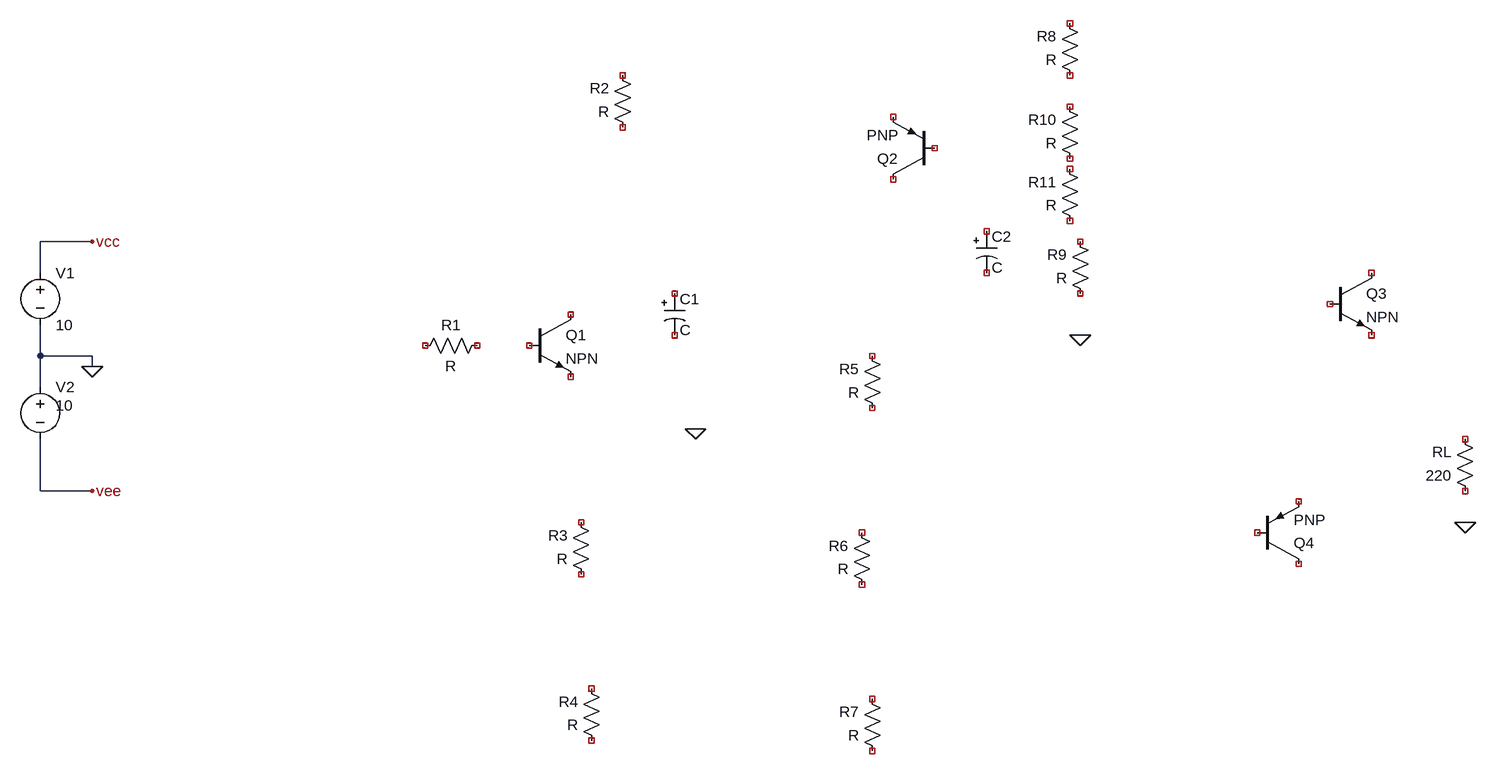
[diagram p0: schematic Draft1.asc]
Draft1.asc, the LTspice schematic file:
Version 4
SHEET 1 1636 776
WIRE -496 -16 -576 -16
WIRE -576 32 -576 -16
WIRE -576 160 -576 112
WIRE -496 160 -576 160
WIRE -496 176 -496 160
WIRE -576 208 -576 160
WIRE -576 368 -576 288
WIRE -496 368 -576 368
FLAG 1616 416 0
FLAG 432 272 0
FLAG 1024 128 0
FLAG -496 176 0
FLAG -496 368 vee
FLAG -496 -16 vcc
SYMBOL res 112 128 R90
WINDOW 0 0 56 VBottom 2
WINDOW 3 32 56 VTop 2
SYMATTR InstName R1
SYMBOL res 336 -176 R180
WINDOW 0 36 76 Left 2
WINDOW 3 36 40 Left 2
SYMATTR InstName R2
SYMBOL res 272 512 R180
WINDOW 0 36 76 Left 2
WINDOW 3 36 40 Left 2
SYMATTR InstName R3
SYMBOL res 288 768 R180
WINDOW 0 36 76 Left 2
WINDOW 3 36 40 Left 2
SYMATTR InstName R4
SYMBOL res 720 256 R180
WINDOW 0 36 76 Left 2
WINDOW 3 36 40 Left 2
SYMATTR InstName R5
SYMBOL res 704 528 R180
WINDOW 0 36 76 Left 2
WINDOW 3 36 40 Left 2
SYMATTR InstName R6
SYMBOL res 720 784 R180
WINDOW 0 36 76 Left 2
WINDOW 3 36 40 Left 2
SYMATTR InstName R7
SYMBOL res 1024 -256 R180
WINDOW 0 36 76 Left 2
WINDOW 3 36 40 Left 2
SYMATTR InstName R8
SYMBOL res 1040 80 R180
WINDOW 0 36 76 Left 2
WINDOW 3 36 40 Left 2
SYMATTR InstName R9
SYMBOL res 1024 -128 R180
WINDOW 0 36 76 Left 2
WINDOW 3 36 40 Left 2
SYMATTR InstName R10
SYMBOL res 1024 -32 R180
WINDOW 0 36 76 Left 2
WINDOW 3 36 40 Left 2
SYMATTR InstName R11
SYMBOL res 1632 384 R180
WINDOW 0 36 76 Left 2
WINDOW 3 36 40 Left 2
SYMATTR InstName RL
SYMATTR Value 220
SYMBOL npn 176 96 R0
SYMATTR InstName Q1
SYMBOL npn 1408 32 R0
SYMATTR InstName Q3
SYMBOL pnp 800 -112 R180
SYMATTR InstName Q2
SYMBOL pnp 1296 480 M180
SYMATTR InstName Q4
SYMBOL polcap 384 64 R0
SYMATTR InstName C1
SYMBOL polcap 864 -32 R0
SYMATTR InstName C2
SYMBOL voltage -576 16 R0
WINDOW 123 0 0 Left 0
WINDOW 39 0 0 Left 0
SYMATTR InstName V1
SYMATTR Value 10
SYMBOL voltage -576 192 R0
WINDOW 3 24 44 Left 2
WINDOW 123 0 0 Left 0
WINDOW 39 0 0 Left 0
SYMATTR InstName V2
SYMATTR Value 10

The netlist it stands for:
* Draft1.asc
R1 NC_01 NC_02 R
R2 NC_03 NC_04 R
R3 NC_05 NC_06 R
R4 NC_07 NC_08 R
R5 NC_09 NC_10 R
R6 NC_11 NC_12 R
R7 NC_13 NC_14 R
R8 NC_15 NC_16 R
R9 NC_17 NC_18 R
R10 NC_19 NC_20 R
R11 NC_21 NC_22 R
RL NC_23 NC_24 220
Q1 NC_25 NC_26 NC_27 0 NPN
Q3 NC_28 NC_29 NC_30 0 NPN
Q2 NC_31 NC_32 NC_33 0 PNP
Q4 NC_34 NC_35 NC_36 0 PNP
C1 NC_37 NC_38 C
C2 NC_39 NC_40 C
V1 vcc 0 10
V2 0 vee 10
.model NPN NPN
.model PNP PNP
.lib standard.bjt
.backanno
.end